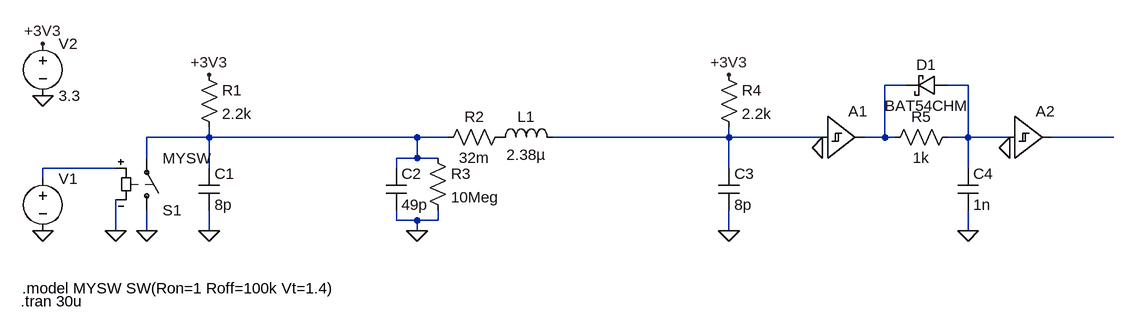
[diagram p0: schematic n64-transmission.asc]
n64-transmission.asc, the LTspice schematic file:
Version 4
SHEET 1 1688 680
WIRE 1296 -32 1264 -32
WIRE 1392 -32 1360 -32
WIRE 224 48 224 32
WIRE 224 48 128 48
WIRE 544 48 224 48
WIRE 592 48 544 48
WIRE 1024 48 1024 32
WIRE 1024 48 752 48
WIRE 1168 48 1024 48
WIRE 1264 48 1264 -32
WIRE 1264 48 1232 48
WIRE 1280 48 1264 48
WIRE 1392 48 1392 -32
WIRE 1392 48 1360 48
WIRE 1456 48 1392 48
WIRE 1616 48 1520 48
WIRE 128 80 128 48
WIRE 544 80 544 48
WIRE 544 80 512 80
WIRE 576 80 544 80
WIRE 80 96 -32 96
WIRE 224 96 224 48
WIRE 512 96 512 80
WIRE 1024 96 1024 48
WIRE 1392 96 1392 48
WIRE -32 112 -32 96
WIRE 512 176 512 160
WIRE 544 176 512 176
WIRE 576 176 576 160
WIRE 576 176 544 176
WIRE 80 192 80 144
WIRE 128 192 128 160
WIRE 224 192 224 160
WIRE 544 192 544 176
WIRE 1024 192 1024 160
WIRE 1392 192 1392 160
FLAG -32 192 0
FLAG 128 192 0
FLAG 80 192 0
FLAG 224 192 0
FLAG -32 -16 0
FLAG -32 -96 +3V3
FLAG 224 -48 +3V3
FLAG 544 192 0
FLAG 1024 -48 +3V3
FLAG 1024 192 0
FLAG 1168 64 0
FLAG 1456 64 0
FLAG 1392 192 0
SYMBOL voltage -32 96 R0
WINDOW 3 24 96 Invisible 2
WINDOW 123 0 0 Left 0
WINDOW 39 0 0 Left 0
SYMATTR InstName V1
SYMATTR Value PWL(0 0 11u 0 11.2u 3.3 12u 3.3 12.2u 0 15u 0 15.2u 3.3 18u 3.3 18.2u 0 19u 0 19.2u 3.3 20u 3.3 20.2u 0 21u 0)
SYMBOL sw 128 176 M180
SYMATTR InstName S1
SYMATTR Value MYSW
SYMBOL cap 208 96 R0
SYMATTR InstName C1
SYMATTR Value 8p
SYMBOL res 208 -64 R0
SYMATTR InstName R1
SYMATTR Value 2.2k
SYMBOL voltage -32 -112 R0
WINDOW 123 0 0 Left 0
WINDOW 39 0 0 Left 0
SYMATTR InstName V2
SYMATTR Value 3.3
SYMBOL res 688 32 R90
WINDOW 0 0 56 VBottom 2
WINDOW 3 32 56 VTop 2
SYMATTR InstName R2
SYMATTR Value 32m
SYMBOL ind 656 64 R270
WINDOW 0 32 56 VTop 2
WINDOW 3 5 56 VBottom 2
SYMATTR InstName L1
SYMATTR Value 2.38µ
SYMBOL cap 496 96 R0
SYMATTR InstName C2
SYMATTR Value 49p
SYMBOL res 560 64 R0
SYMATTR InstName R3
SYMATTR Value 10Meg
SYMBOL res 1008 -64 R0
SYMATTR InstName R4
SYMATTR Value 2.2k
SYMBOL cap 1008 96 R0
SYMATTR InstName C3
SYMATTR Value 8p
SYMBOL Digital\\schmtbuf 1168 -16 R0
SYMATTR InstName A1
SYMATTR SpiceLine Vhigh=3.3 Vt=2.4
SYMATTR SpiceLine2 Trise=6n Tfall=6n Td=15n
SYMBOL Digital\\schmtbuf 1456 -16 R0
SYMATTR InstName A2
SYMATTR SpiceLine Vhigh=3.3 Vt=2.4
SYMATTR SpiceLine2 Trise=6n Tfall=6n Td=15n
SYMBOL cap 1376 96 R0
SYMATTR InstName C4
SYMATTR Value 1n
SYMBOL schottky 1360 -48 R90
WINDOW 0 0 32 VBottom 2
WINDOW 3 32 32 VTop 2
SYMATTR InstName D1
SYMATTR Value BAT54CHM
SYMATTR Description Diode
SYMATTR Type diode
SYMBOL res 1376 32 R90
WINDOW 0 0 56 VBottom 2
WINDOW 3 32 56 VTop 2
SYMATTR InstName R5
SYMATTR Value 1k
TEXT -64 280 Left 2 !.model MYSW SW(Ron=1 Roff=100k Vt=1.4)
TEXT -66 300 Left 2 !.tran 30u

The netlist it stands for:
* n64-transmission.asc
V1 N006 0 PWL(0 0 11u 0 11.2u 3.3 12u 3.3 12.2u 0 15u 0 15.2u 3.3 18u 3.3 18.2u 0 19u 0 19.2u 3.3 20u 3.3 20.2u 0 21u 0)
S1 0 N003 N006 0 MYSW
C1 N003 0 8p
R1 +3V3 N003 2.2k
V2 +3V3 0 3.3
R2 P001 N003 32m
L1 P001 N004 2.38µ
C2 N003 0 49p
R3 N003 0 10Meg
R4 +3V3 N004 2.2k
C3 N004 0 8p
A1 N004 0 0 0 0 0 N001 0 SCHMITT Vhigh=3.3 Vt=2.4 Trise=6n Tfall=6n Td=15n
A2 N002 0 0 0 0 0 N005 0 SCHMITT Vhigh=3.3 Vt=2.4 Trise=6n Tfall=6n Td=15n
C4 N002 0 1n
D1 N002 N001 BAT54CHM
R5 N002 N001 1k
.model D D
.lib standard.dio
.model MYSW SW(Ron=1 Roff=100k Vt=1.4)
.tran 30u
.backanno
.end